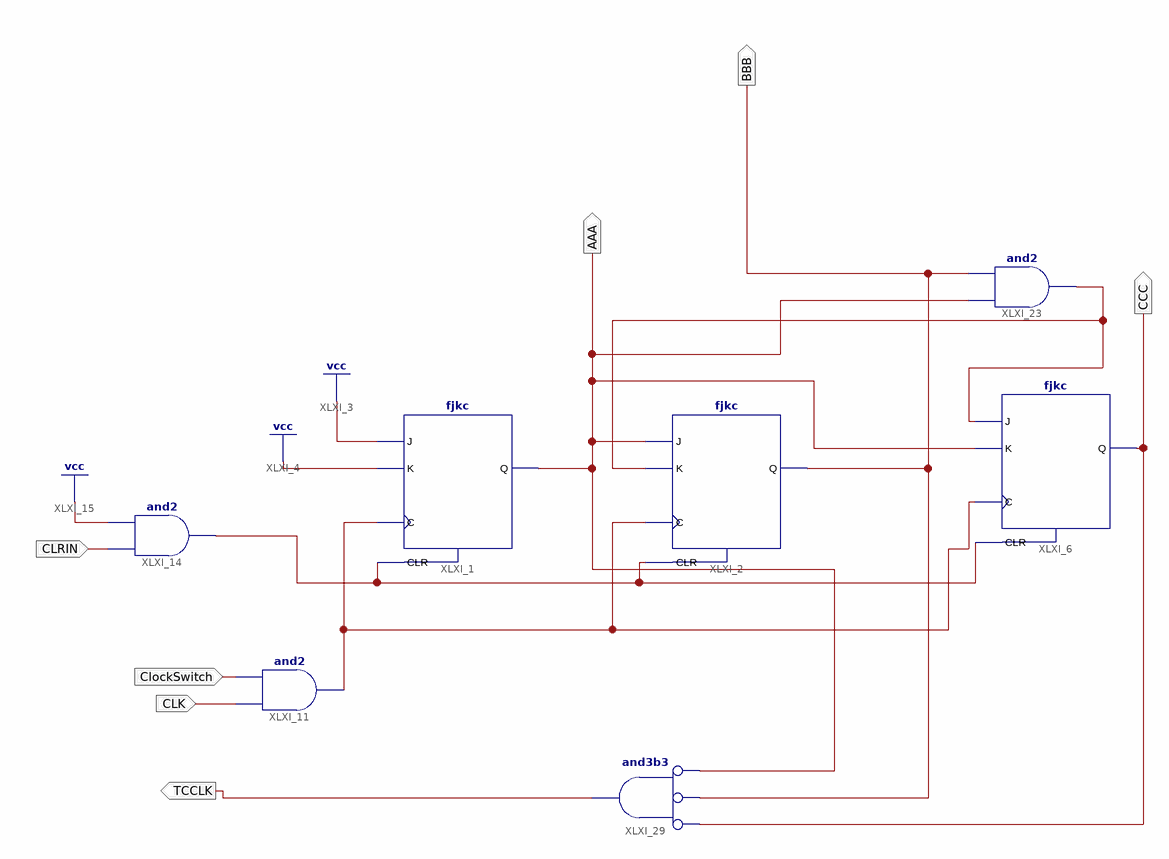
[diagram p0: schematic sheet 1]
// Xilinx ISE schematic FLIPFLOP1_5.sch (spartan6) as structural Verilog: 7 symbols, 7 ports
module FLIPFLOP1_5 (
  input  ClockSwitch,
  input  CLK,
  input  CLRIN,
  output TCCLK,
  output AAA,
  output BBB,
  output CCC
);

  wire outtoggle, XLXN_7, XLXN_43;

  fjkc XLXI_1 (.C(XLXN_7), .CLR(outtoggle), .J(1'b1), .K(1'b1), .Q(AAA));
  fjkc XLXI_2 (.C(XLXN_7), .CLR(outtoggle), .J(AAA), .K(XLXN_43), .Q(BBB));
  fjkc XLXI_6 (.C(XLXN_7), .CLR(outtoggle), .J(XLXN_43), .K(AAA), .Q(CCC));
  and XLXI_14 (outtoggle, CLRIN, 1'b1);
  and XLXI_11 (XLXN_7, CLK, ClockSwitch);
  and XLXI_23 (XLXN_43, AAA, BBB);
  and XLXI_29 (TCCLK, ~AAA, ~BBB, ~CCC);  // and3b3
endmodule
